# EAGLE schematic hes_power_board (EAGLE 8.2.2)
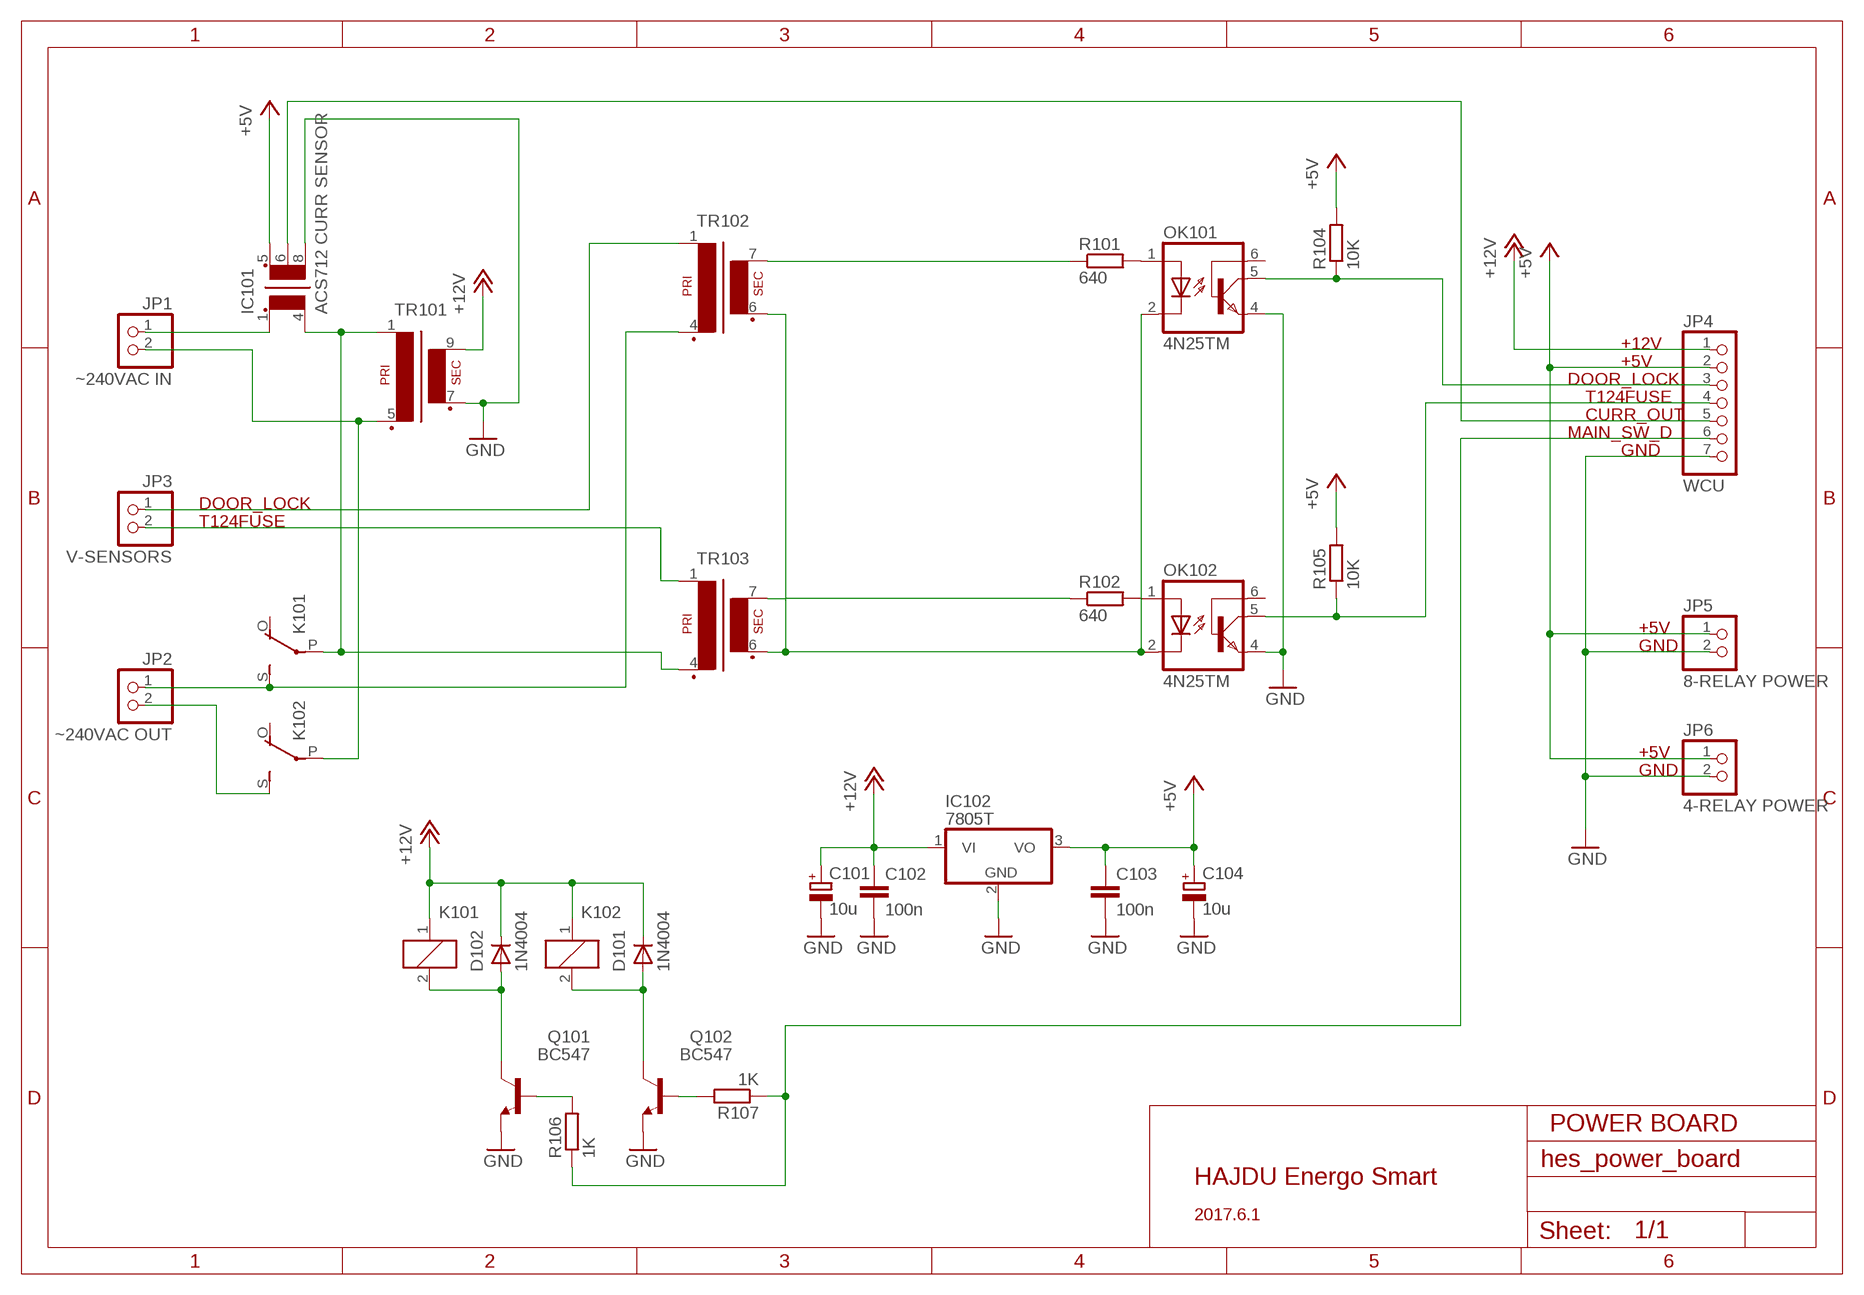
[diagram p0: schematic, sheet 1]

## Parts
C101  10u  CPOL-EU085CS-1AR  [085CS_1AR]
C102  100n  CXXC10B5  [XC10B5]
C103  100n  CXXC10B5  [XC10B5]
C104  10u  CPOL-EU085CS-1AR  [085CS_1AR]
D101  1N4004  GF1  [SMA-DO214AC]
D102  1N4004  GF1  [SMA-DO214AC]
IC101  ACS712 CURR SENSOR  CTX02-14659  [CTX02-14659]
IC102  7805T  [TO220H]
JP1  ~240VAC IN  PINHD-1X2  [1X02]
JP2  ~240VAC OUT  PINHD-1X2  [1X02]
JP3  V-SENSORS  PINHD-1X2  [1X02]
JP4  WCU  PINHD-1X7  [1X07]
JP5  8-RELAY POWER  PINHD-1X2  [1X02]
JP6  4-RELAY POWER  PINHD-1X2  [1X02]
K101  E3206S  [E3206S]
K102  E3206S  [E3206S]
OK101  4N25TM  [DIL6-04]
OK102  4N25TM  [DIL6-04]
Q101  BC547  [TO92]
Q102  BC547  [TO92]
R101  640  R-EU_0204/5  [0204/5]
R102  640  R-EU_0204/5  [0204/5]
R104  10K  R-EU_0204/5  [0204/5]
R105  10K  R-EU_0204/5  [0204/5]
R106  1K  R-EU_0204/5  [0204/5]
R107  1K  R-EU_0204/5  [0204/5]
TR101  EI30-1  [EI30-1]
TR102  EE20-1  [EE20-1]
TR103  EE20-1  [EE20-1]

## Nets
+5V: C103.1 C104.+ IC101.5 IC102.3(VO) JP4.2 JP5.1 JP6.1 R104.2 R105.2
+12V: C101.+ C102.1 D101.K(C) D102.K(C) IC102.1(VI) JP4.1 K101.1 K102.1 TR101.9(S4)
GND: C101.- C102.2 C103.2 C104.- IC101.8 IC102.2(GND) JP5.2 JP6.2 OK101.4(EMI) OK102.4(EMI) Q101.1(E) Q102.1(E) TR101.7(S3)
N$1: OK101.1(A) R101.2
N$2: IC101.1
N$3: TR102.4(P2)
N$4: JP4.3 OK101.5(COL) R104.1
N$6: JP4.4 OK102.5(COL) R105.1
N$8: R101.1 TR102.7(S4)
N$9: JP2.2 K102.S(2:S)
N$10: OK101.2(C) OK102.2(C) TR102.6(S3) TR103.6(S3) TR103.7(S4)
N$11: K102.P(2:P) TR101.5(P2)
N$13: R102.1
N$14: K101.S(2:S)
N$15: TR102.1
N$16: D101.A K102.2 Q102.3(C)
N$17: TR103.1
N$18: D102.A K101.2 Q101.3(C)
N$19: Q101.2(B) R106.2
N$20: OK102.1(A) R102.2
N$21: IC101.6 JP4.5
N$22: Q102.2(B) R107.2
N$23: IC101.4 K101.P(2:P) TR101.1 TR103.4(P2)
N$24: JP4.6 R106.1 R107.1
Unconnected: JP1.1 JP1.2 JP2.1 JP3.1 JP3.2 JP4.7 K101.O(2:O) K102.O(2:O) OK101.6(BAS) OK102.6(BAS)

## Notes on the sheet
- +12V
- +5V
- DOOR_LOCK
- T124FUSE
- CURR_OUT
- MAIN_SW_D
- GND
- DOOR_LOCK
- T124FUSE
- +5V
- GND
- +5V
- GND
- POWER BOARD
- HAJDU Energo Smart
- 2017.6.1

## Library data of the parts
C101 C104 = rcl:CPOL-EU: POLARIZED CAPACITOR, European symbol
C102 C103 = rcl:CX: X CAPACITOR for power line
D101 D102 = diode:GF1: DIODE
IC101 = trafo:CTX02-14659: Transformer, Push-Pull 300kHz, 547uH, ER 9.5, SMT, gull wing, 8 pads Source: COOPERE ELECTRONIC TECHNOLOGIES .. ctx02-14659.pdf
IC102 = linear:78*: Positive VOLTAGE REGULATOR Source: http://cache.national.com/ds/LM/LM78L05.pdf http://www.fairchildsemi.com/ds/LM/LM7805.pdf
JP1-JP3 JP5 JP6 = pinhead:PINHD-1X2: PIN HEADER
JP4 = pinhead:PINHD-1X7: PIN HEADER
K101 K102 = relay:E3206S: RELAY 1 x switch, Eichhoff/distributor Schukat; OC_FARNELL: unknown; OC_NEWARK: unknown
OK101 OK102 = optocoupler:4N*?M: General Purpose 6-Pin Phototransistor Optocouplers Source: http://www.fairchildsemi.com/ds/4N/4N35-M.pdf; OC_FARNELL: unknown; OC_NEWARK: unknown
Q101 Q102 = transistor-npn:BC547*: NPN Transistor
R101 R102 R104-R107 = resistor:R-EU_: RESISTOR, European symbol
TR101 = trafo:EI30-1: TRANSFORMER 1 primary winding, 1 secondary winding ERA
TR102 TR103 = trafo:EE20-1: TRANSFORMER 1 primary winding, 1 secondary winding ERA